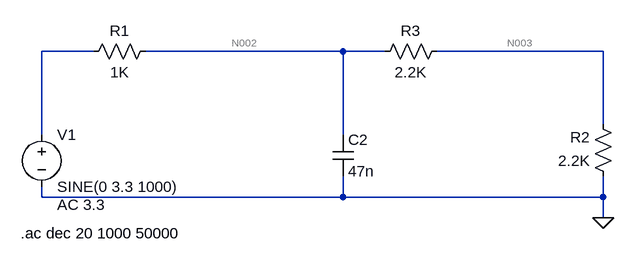
[diagram p0: schematic Audio_Trap_03.asc]
Audio_Trap_03.asc, the LTspice schematic file:
Version 4
SHEET 1 880 680
WIRE 48 32 -32 32
WIRE 432 32 128 32
WIRE 496 32 432 32
WIRE 832 32 576 32
WIRE 832 144 832 32
WIRE -32 160 -32 32
WIRE 432 160 432 32
WIRE -32 256 -32 240
WIRE 432 256 432 224
WIRE 432 256 -32 256
WIRE 832 256 832 224
WIRE 832 256 432 256
WIRE 832 288 832 256
FLAG 832 288 0
SYMBOL res 144 16 R90
WINDOW 0 0 56 VBottom 2
WINDOW 3 32 56 VTop 2
SYMATTR InstName R1
SYMATTR Value 1K
SYMBOL res 848 240 R180
WINDOW 0 36 76 Left 2
WINDOW 3 36 40 Left 2
SYMATTR InstName R2
SYMATTR Value 2.2K
SYMBOL voltage -32 144 R0
WINDOW 123 24 124 Left 2
WINDOW 39 0 0 Left 0
SYMATTR Value2 AC 3.3
SYMATTR InstName V1
SYMATTR Value SINE(0 3.3 1000)
SYMBOL cap 416 160 R0
SYMATTR InstName C2
SYMATTR Value 47n
SYMBOL res 592 16 R90
WINDOW 0 0 56 VBottom 2
WINDOW 3 32 56 VTop 2
SYMATTR InstName R3
SYMATTR Value 2.2K
TEXT -64 312 Left 2 !.ac dec 20 1000 50000

The netlist it stands for:
* Audio_Trap_03.asc
R1 N002 N001 1K
R2 0 N003 2.2K
V1 N001 0 SINE(0 3.3 1000) AC 3.3
C2 N002 0 47n
R3 N003 N002 2.2K
.ac dec 20 1000 50000
.backanno
.end

* Results of the author's LTspice run, read from the files saved beside the schematic
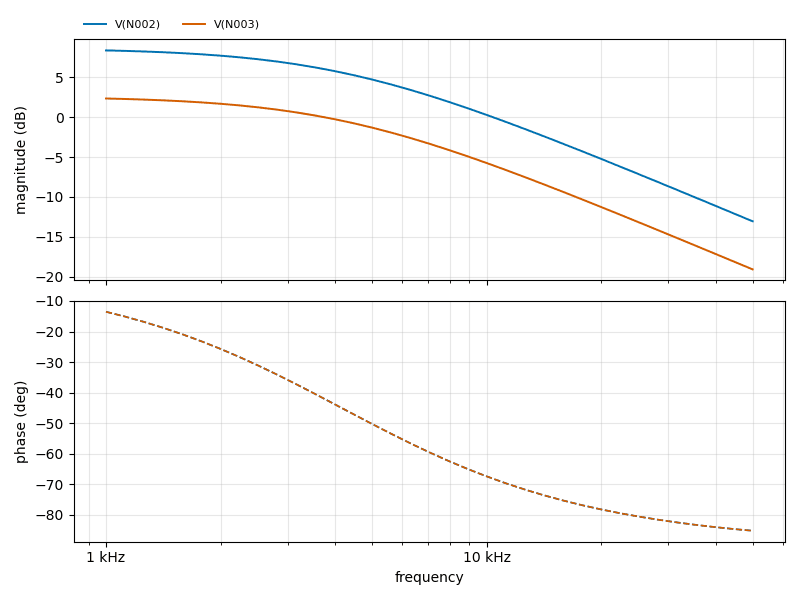
[diagram p1: AC Analysis of Audio_Trap_03.asc, plotted from the saved traces]
* AC Analysis, 1 run:
*   V(N002): 8.35 dB at 1 kHz, -13.04 dB at 50 kHz, peak 8.35 dB at 1 kHz, 3 dB below the peak at 4.386 kHz
*   V(N003): 2.33 dB at 1 kHz, -19.07 dB at 50 kHz, peak 2.33 dB at 1 kHz, 3 dB below the peak at 4.386 kHz